# EAGLE design VOC_SensorBoard (EAGLE 7.2.0)
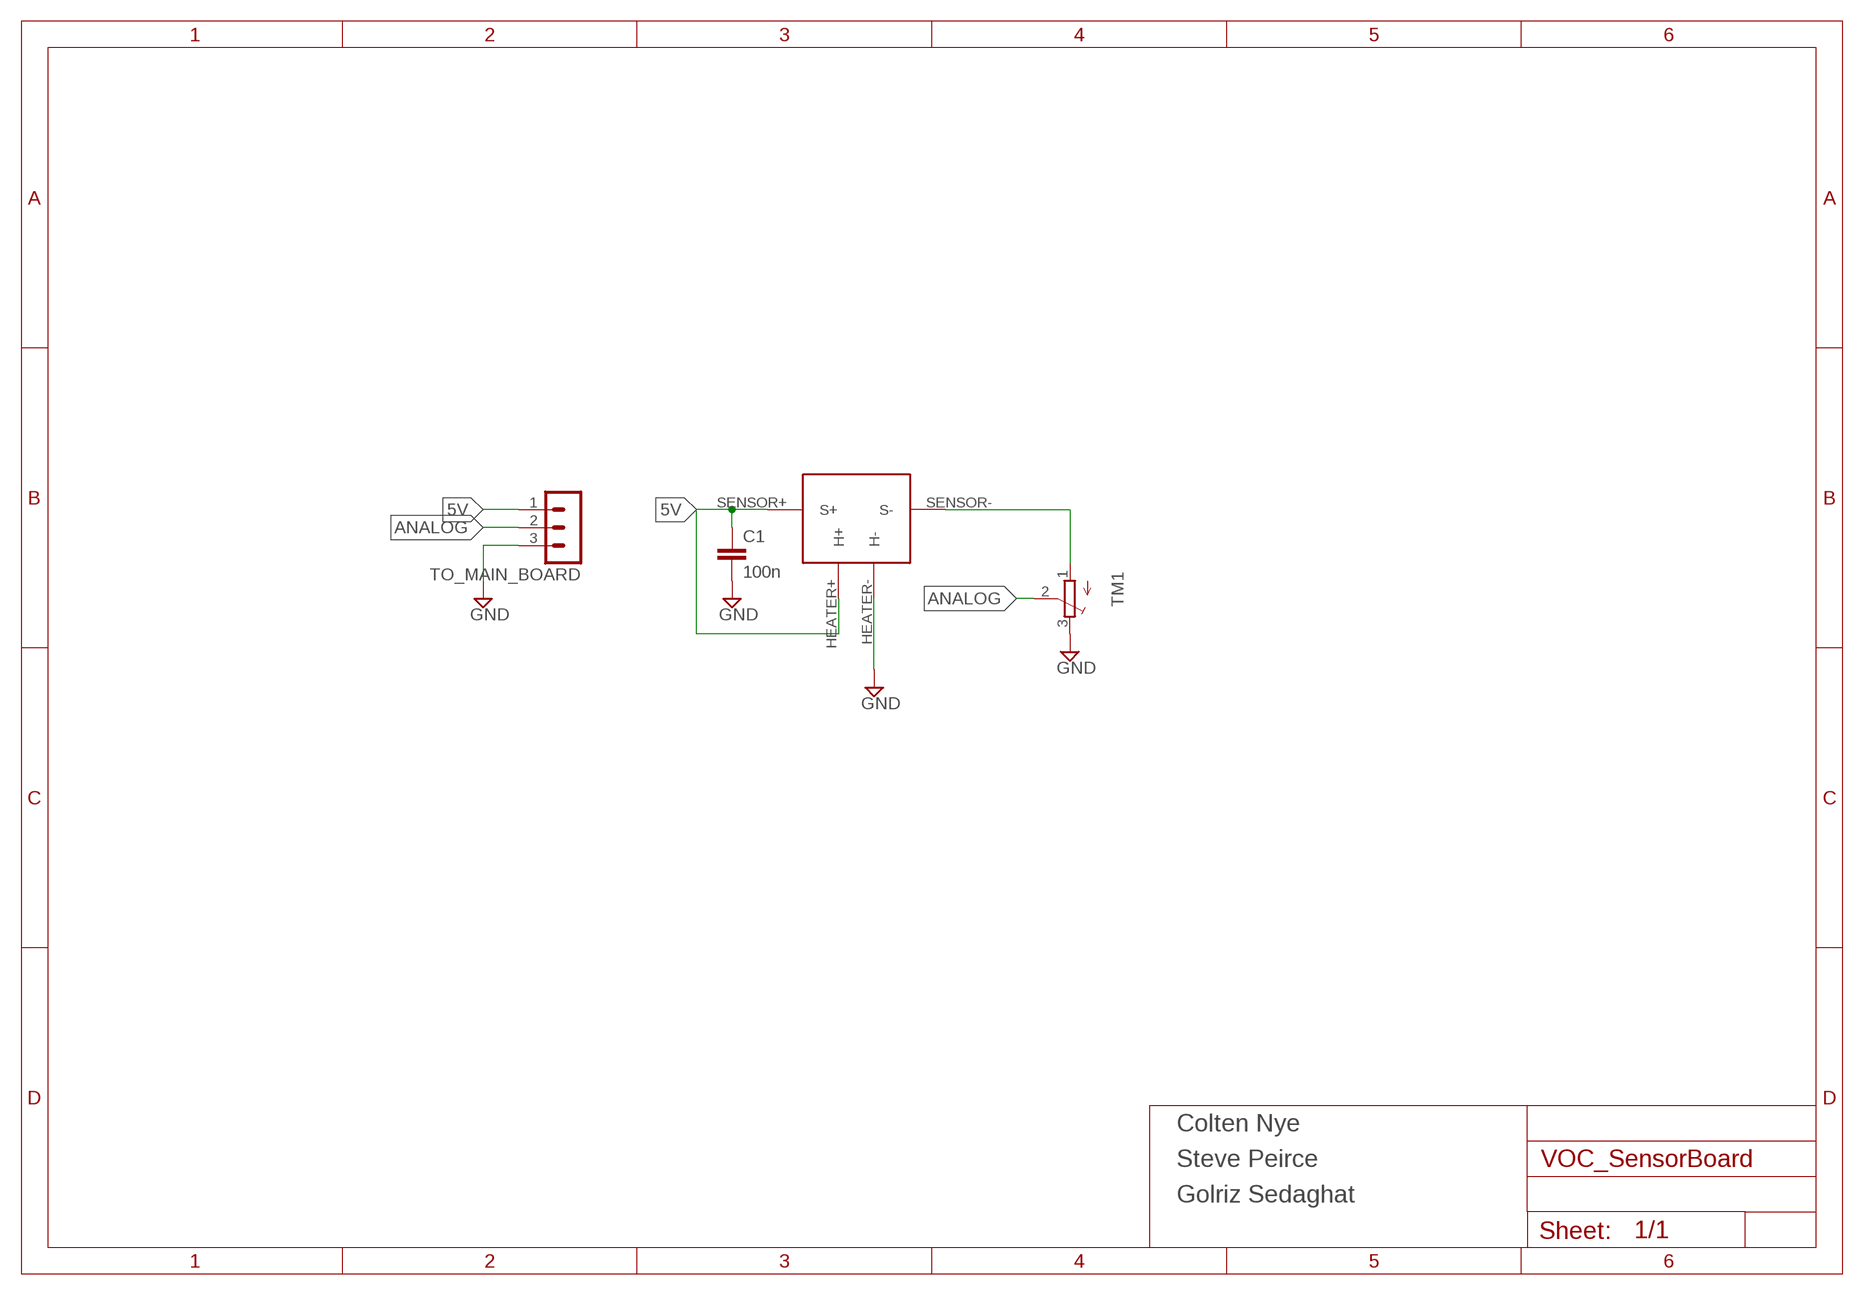
[diagram p0: schematic, sheet 1]

## Parts
C1  100n  C-EUC0805  [C0805]
TM1  TRIMPOTTC33X  [TC33X]
TO_MAIN_BOARD  MA03-1  [MA03-1]
U$1  TGS2602  [TGS2602]

## Nets
5V: C1.1 TO_MAIN_BOARD.1 U$1.HEATER+(H+) U$1.SENSOR+(S+)
ANALOG: TM1.2(S) TO_MAIN_BOARD.2
GND: C1.2 TM1.3(E) TO_MAIN_BOARD.3 U$1.HEATER-(H-)
N$3: TM1.1(A) U$1.SENSOR-(S-)

## Notes on the sheet
- Colten Nye
- Steve Peirce
- Golriz Sedaghat

## Library data of the parts
C1 = rcl:C-EU: CAPACITOR, European symbol
TM1 = adafruit:TRIMPOT: SMT trimmer potentiometer part number TC33X http://www.ladyada.net/library/eagle
TO_MAIN_BOARD = con-lstb:MA03-1: PIN HEADER; OC_FARNELL: unknown; OC_NEWARK: unknown
U$1 = spark:TGS2602

## Board
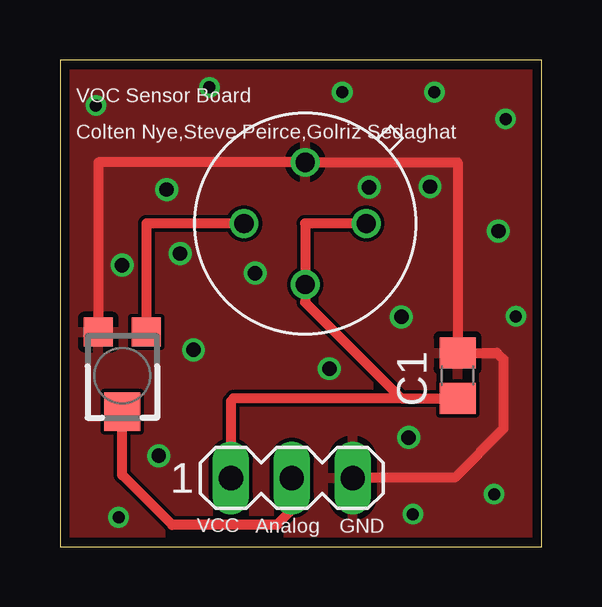
[diagram p1: board, top side]
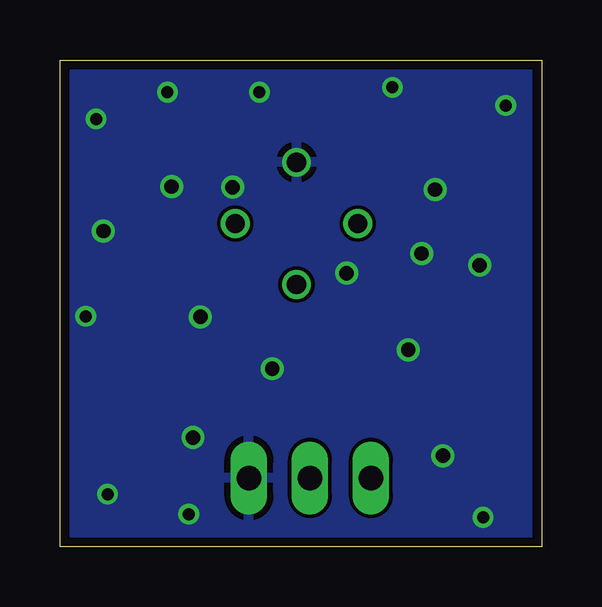
[diagram p2: board, bottom side, seen from below]

Size 20.07 x 20.29 mm. Coordinates in mm from the lower left corner, seen from the top.
Outline: 0,0 20.07,0 20.07,20.29 0,20.29 0,0
Copper layers (1*16): Top 0.0356mm / dielectric 1.5011mm / Bottom 0.0356mm
Design rules "oshpark-2layer": minimum track width 6mil, minimum drill 13mil, track to track 6mil, track to pad 6mil, pad to pad 6mil, via to via 6mil, smd to smd 6mil, copper to edge 15mil, drill to drill 6mil, minimum pad ring 7mil, minimum via ring 7mil, stop-mask expansion 4mil, vias tented up to drill 0mil, thermal gap 10mil

### Footprints (pad centres in the part's own frame; a part is rotated, then mirrored left to right if it is on the bottom)
C0805 = smd 1.3 x 1.5: 1 -0.95,0; 2 0.95,0
TC33X = smd 1.2 x 1.2: 1 -1,-1.825; 3 1,-1.825 | smd 1.5 x 1.6: 2 0,1.5
MA03-1 = drill 1.016 long: 1 -2.54,0; 2 0,0; 3 2.54,0
TGS2602 = drill 0.8: HEATER+ 2.55,0; HEATER- 0,2.55; SENSOR+ 0,-2.55; SENSOR- -2.55,0

### Placement (x,y rotation side)
C1  16.57,7.12 90 top
TM1  2.6,7.12 180 top
TO_MAIN_BOARD  9.66,2.86 0 top
U$1  10.22,13.47 0 top

### Tracks (layer width: path | path; a pad name or v marks a point on that pad's centre or on a via)
5V
  Top 0.406: U$1.HEATER+ 10.22,13.47 U$1.SENSOR+ 10.22,10.19 14.22,6.18 | 14.22,6.18 C1.1 | 14.22,6.18 7.23,6.18 7.12,6.06 TO_MAIN_BOARD.1
ANALOG
  Top 0.406: TO_MAIN_BOARD.2 9.66,1.53 9.04,0.9 4.67,0.9 2.59,2.98 TM1.2
GND  (via drill 0.5 pad 0.25, 0.6)
  Top 0.406: TM1.3 1.6,16.02 U$1.HEATER- 16.57,16.02 C1.2 18.21,8.07 18.48,7.8 18.48,4.91 16.44,2.87 12.21,2.87 TO_MAIN_BOARD.3
  other vias: 1.5,18.39 4.45,14.88 2.59,11.73 5.56,8.2 4.11,3.78 2.44,1.22 14.71,1.35 14.53,4.55 18.08,2.18 19,9.6 14.22,9.58 11.23,7.42 18.26,13.16 15.42,15.01 18.57,17.83 15.6,18.95 11.76,18.95 12.88,14.99 8.13,11.4 5,12.22 6.22,19.15
  pour Top: 0,20.32 20.07,20.32 20.07,0 0,0
  pour Bottom: 0.03,20.32 20.12,20.35 20.07,0 0.03,0
N$3
  Top 0.406: U$1.SENSOR- 3.6,13.47 TM1.1

### Text on the board
tNames: VOC Sensor Board | Colten Nye,Steve Peirce,Golriz Sedaghat | VCC | Analog | GND